# Altium schematic sheet motherboard_motor_mcu.SchDoc: =title_line_1 + title_line_2
size 840 x 594 mm; SheetNumber: 2; SheetTotal: 5
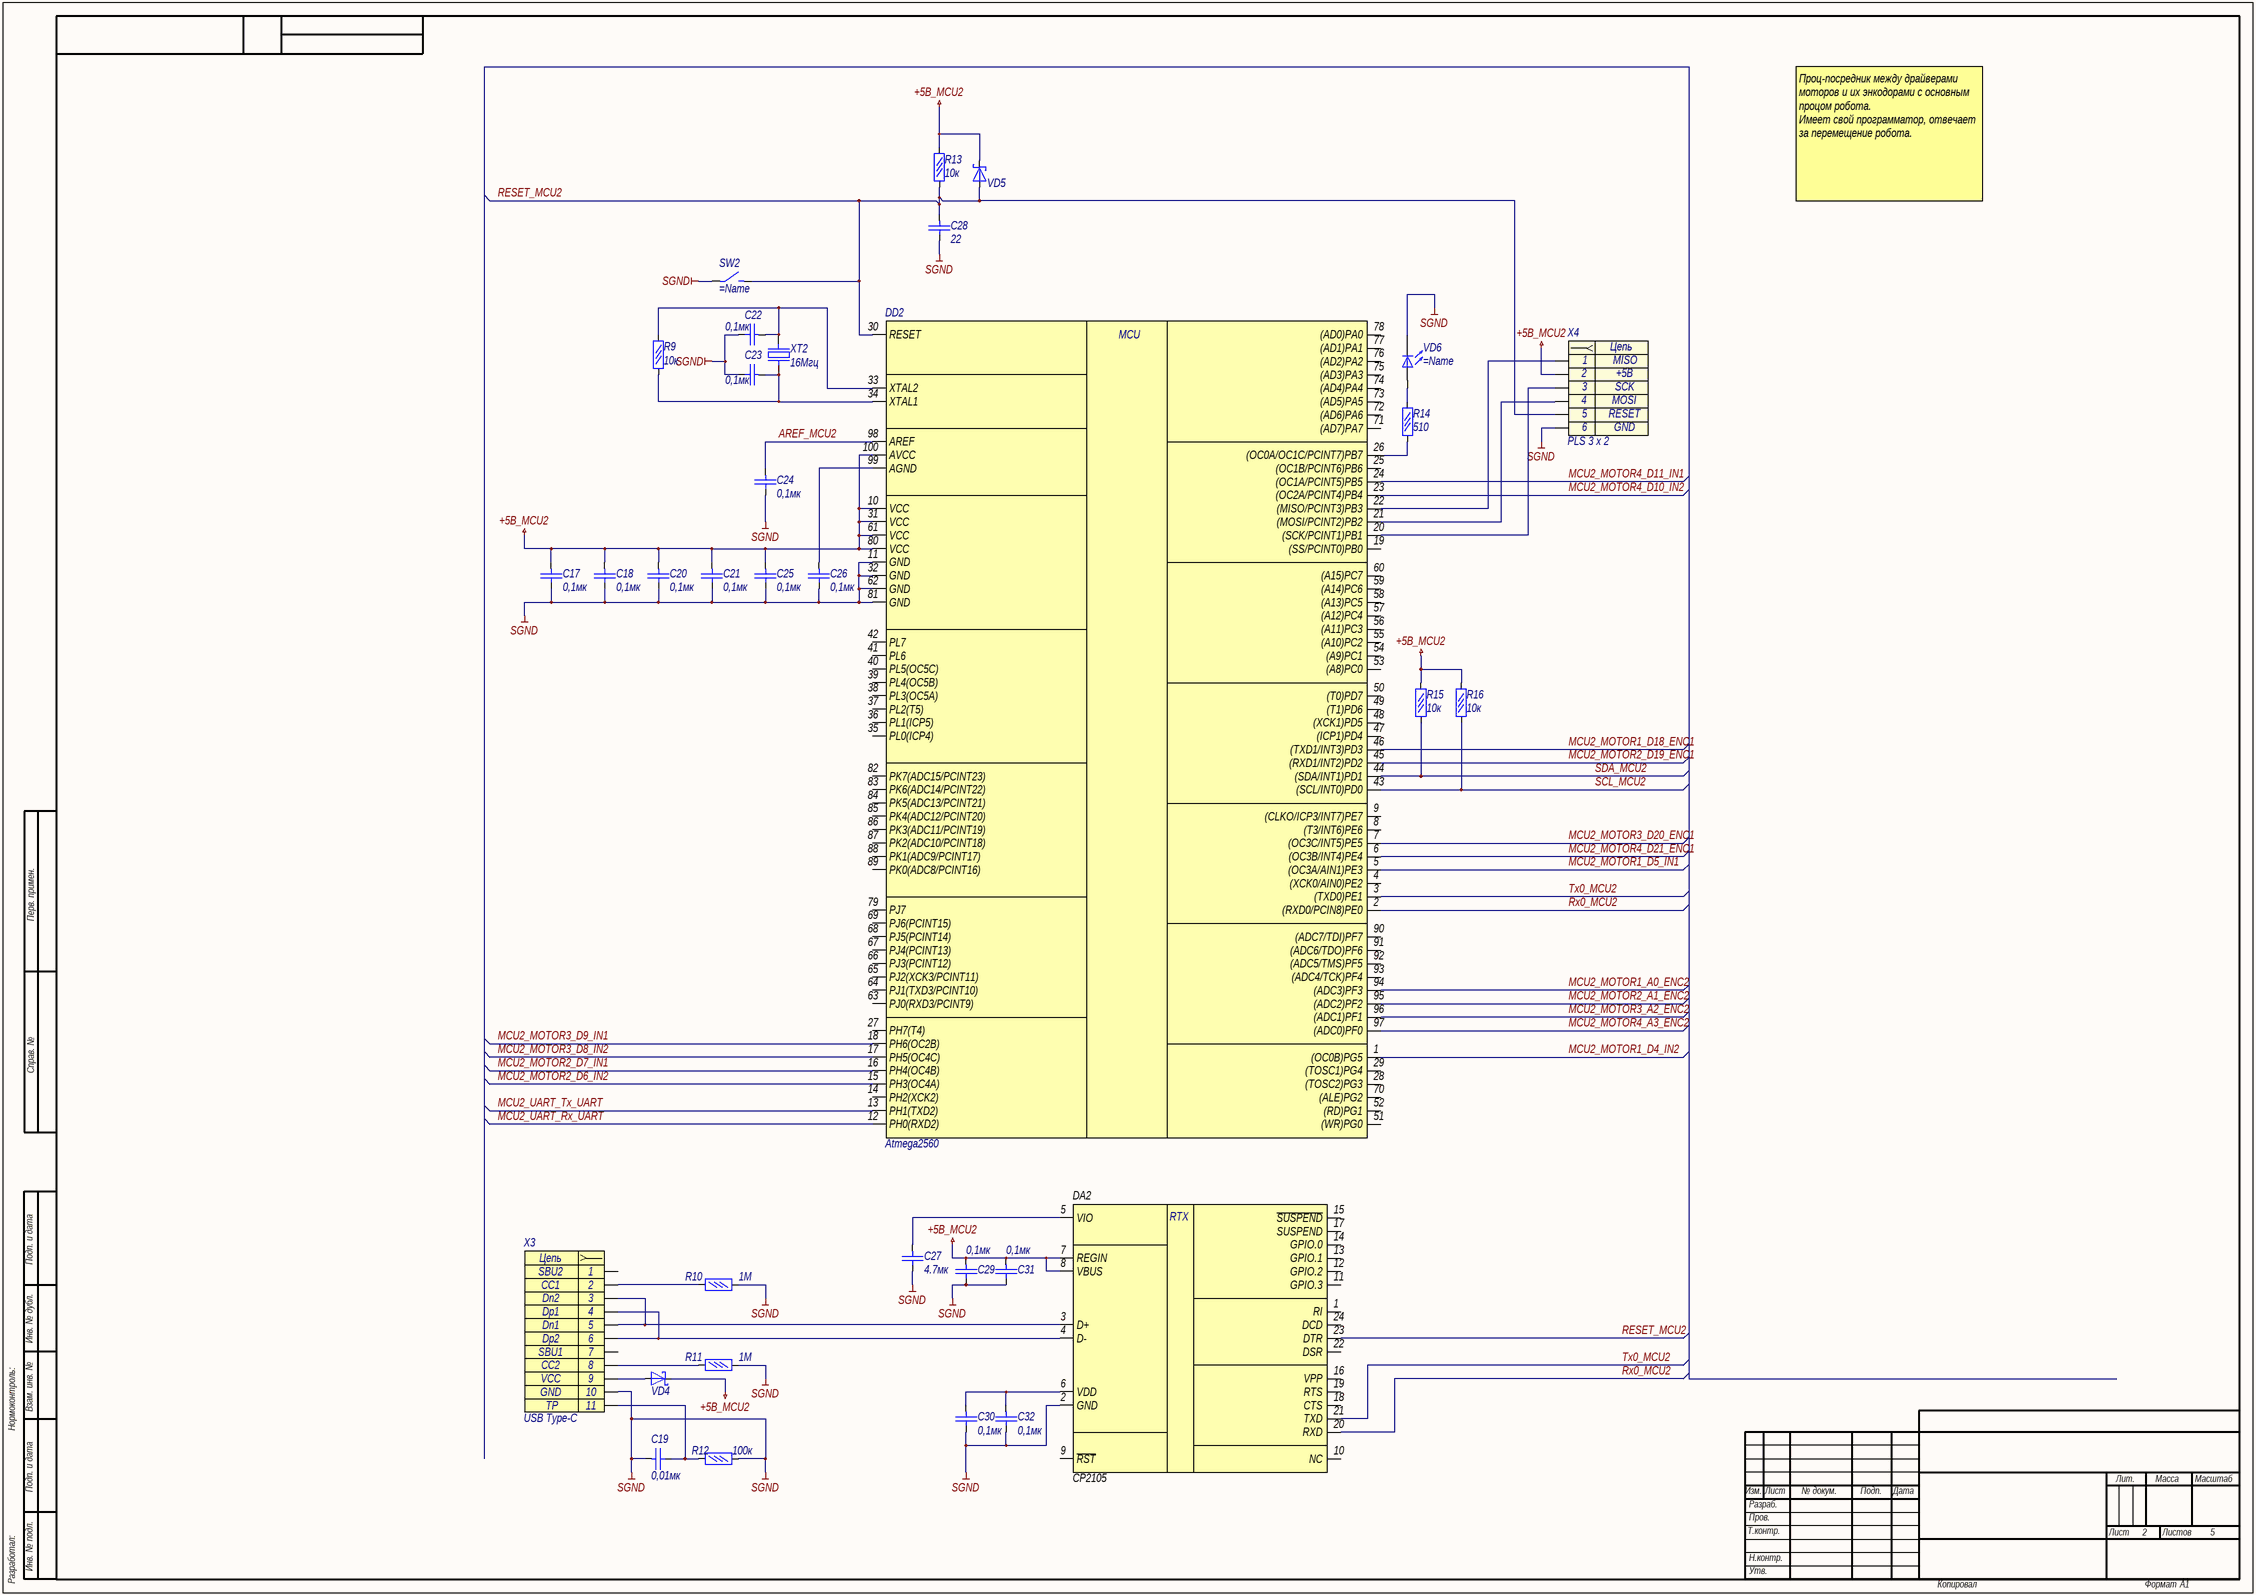
[diagram p0: motherboard_motor_mcu.SchDoc]

## Parts
DA2  CP2105  [QFN24-PAD]
DD2  Atmega2560  [100A]
R9  10к  [R0603]
R10  1М  [R0603]
R11  1М  [R0603]
R12  100к  [R0603]
R13  10к  [R0603]
R14  510  [R0603]
R15  10к  [R0603]
R16  10к  [R0603]
SW2  (no value)  [it-1187]
VD4  (no value)  [SOD123_A]
VD5  (no value)  [SOD123_A]
VD6  (no value)  [0603 - led]
X3  USB Type-C  [USB4105-15-A-120]
X4  PLS 3 x 2  [PLS 3 x 2]
XT2  16Мгц  [KX-7]
С17  0,1мк  [C0402]
С18  0,1мк  [C0402]
С19  0,01мк  [C0603]
С20  0,1мк  [C0402]
С21  0,1мк  [C0402]
С22  0,1мк  [C0402]
С23  0,1мк  [C0402]
С24  0,1мк  [C0402]
С25  0,1мк  [C0402]
С26  0,1мк  [C0402]
С27  4.7мк  [C0603]
С28  22  [C0603]
С29  0,1мк  [C0603]
С30  0,1мк  [C0603]
С31  0,1мк  [C0603]
С32  0,1мк  [C0603]

## Nets
+5В_MCU2: DA2.7(REGIN) DA2.8(VBUS) DD2.10(VCC) DD2.31(VCC) DD2.61(VCC) DD2.80(VCC) DD2.100(AVCC) R13.2 R15.1 R16.1 VD4.1(K) VD5.1(K) X4.2 С17.2 С18.2 С20.2 С21.2 С25.2 С29.2 С31.2
SGND: DA2.2(GND) DD2.11(GND) DD2.32(GND) DD2.62(GND) DD2.81(GND) R10.2 R11.2 R12.2 SW2.1 VD6.2(K) X3.10(VCC) X4.6 С17.1 С18.1 С19.2 С20.1 С21.1 С22.1 С23.1 С24.1 С25.1 С26.1 С27.1 С28.1 С29.1 С30.1 С31.1 С32.1
AREF_MCU2: DD2.98(AREF) С24.2
MCU2_MOTOR1_A0_ENC2: DD2.94((ADC3)PF3)
MCU2_MOTOR1_D4_IN2: DD2.1((OC0B)PG5)
MCU2_MOTOR1_D5_IN1: DD2.5((OC3A/AIN1)PE3)
MCU2_MOTOR1_D18_ENC1: DD2.46((TXD1/INT3)PD3)
MCU2_MOTOR2_A1_ENC2: DD2.95((ADC2)PF2)
MCU2_MOTOR2_D6_IN2: DD2.15(PH3(OC4A))
MCU2_MOTOR2_D7_IN1: DD2.16(PH4(OC4B))
MCU2_MOTOR2_D19_ENC1: DD2.45((RXD1/INT2)PD2)
MCU2_MOTOR3_A2_ENC2: DD2.96((ADC1)PF1)
MCU2_MOTOR3_D8_IN2: DD2.17(PH5(OC4C))
MCU2_MOTOR3_D9_IN1: DD2.18(PH6(OC2B))
MCU2_MOTOR3_D20_ENC1: DD2.7((OC3C/INT5)PE5)
MCU2_MOTOR4_A3_ENC2: DD2.97((ADC0)PF0)
MCU2_MOTOR4_D10_IN2: DD2.23((OC2A/PCINT4)PB4)
MCU2_MOTOR4_D11_IN1: DD2.24((OC1A/PCINT5)PB5)
MCU2_MOTOR4_D21_ENC1: DD2.6((OC3B/INT4)PE4)
MCU2_UART_Rx_UART: DD2.12(PH0(RXD2))
MCU2_UART_Tx_UART: DD2.13(PH1(TXD2))
RESET_MCU2: DA2.23(DTR) DD2.30(RESET) R13.1 SW2.2 VD5.2(A) X4.5 С28.2
Rx0_MCU2: DA2.20(RXD) DD2.2((RXD0/PCIN8)PE0)
SCL_MCU2: DD2.43((SCL/INT0)PD0) R16.2
SDA_MCU2: DD2.44((SDA/INT1)PD1) R15.2
Tx0_MCU2: DA2.21(TXD) DD2.3((TXD0)PE1)
NetDA2_3: DA2.3(D+) X3.3(B7) X3.5(A7)
NetDA2_4: DA2.4(D-) X3.4(A6) X3.6(B6)
NetDA2_5: DA2.5(VIO) С27.2
NetDA2_6: DA2.6(VDD) С30.2 С32.2
NetDD2_20: DD2.20((SCK/PCINT1)PB1) X4.3
NetDD2_21: DD2.21((MOSI/PCINT2)PB2) X4.4
NetDD2_22: DD2.22((MISO/PCINT3)PB3) X4.1
NetDD2_26: DD2.26((OC0A/OC1C/PCINT7)PB7) R14.2
NetDD2_33: DD2.33(XTAL2) R9.2 XT2.3 С22.2
NetDD2_34: DD2.34(XTAL1) R9.1 XT2.1 С23.2
NetDD2_99: DD2.99(AGND) С26.2
NetR10_1: R10.1 X3.2(A5)
NetR11_1: R11.1 X3.8(B5)
NetR12_1: R12.1 X3.TP С19.1
NetR14_1: R14.1 VD6.1(A)
NetVD4_2: VD4.2(A) X3.9(GND)

Not connected (* = marked no-connect by the designer): DA2 1(RI) 9(~{RST}) 10(NC) 11(GPIO.3) 12(GPIO.2) 13(GPIO.1) 14(GPIO.0) 15(~{SUSPEND}) 16(VPP) 17(SUSPEND) 18(CTS) 19(RTS) 22(DSR) 24(DCD); DD2 4((XCK0/AIN0)PE2) 8((T3/INT6)PE6) 9((CLKO/ICP3/INT7)PE7) 14(PH2(XCK2)) 19((SS/PCINT0)PB0) 25((OC1B/PCINT6)PB6) 27(PH7(T4)) 28((TOSC2)PG3) 29((TOSC1)PG4) 35(PL0(ICP4)) 36(PL1(ICP5)) 37(PL2(T5)) 38(PL3(OC5A)) 39(PL4(OC5B)) 40(PL5(OC5C)) 41(PL6) 42(PL7) 47((ICP1)PD4) 48((XCK1)PD5) 49((T1)PD6) 50((T0)PD7) 51((WR)PG0) 52((RD)PG1) 53((A8)PC0) 54((A9)PC1) 55((A10)PC2) 56((A11)PC3) 57((A12)PC4) 58((A13)PC5) 59((A14)PC6) 60((A15)PC7) 63(PJ0(RXD3/PCINT9)) 64(PJ1(TXD3/PCINT10)) 65(PJ2(XCK3/PCINT11)) 66(PJ3(PCINT12)) 67(PJ4(PCINT13)) 68(PJ5(PCINT14)) 69(PJ6(PCINT15)) 70((ALE)PG2) 71((AD7)PA7) 72((AD6)PA6) 73((AD5)PA5) 74((AD4)PA4) 75((AD3)PA3) 76((AD2)PA2) 77((AD1)PA1) 78((AD0)PA0) 79(PJ7) 82(PK7(ADC15/PCINT23)) 83(PK6(ADC14/PCINT22)) 84(PK5(ADC13/PCINT21)) 85(PK4(ADC12/PCINT20)) 86(PK3(ADC11/PCINT19)) 87(PK2(ADC10/PCINT18)) 88(PK1(ADC9/PCINT17)) 89(PK0(ADC8/PCINT16)) 90((ADC7/TDI)PF7) 91((ADC6/TDO)PF6) 92((ADC5/TMS)PF5) 93((ADC4/TCK)PF4); X3 1(B8) 7(A8)

## Notes on the sheet
- Проц-посредник между драйверами моторов и их энкодорами с основным процом робота.
  Имеет свой программатор, отвечает за перемещение робота.
- Перв. примен.
- Справ. №
- Подп. и дата
- Инв. № дубл.
- Нормоконтроль:
- Взам. инв. №
- Изм.
- Лист
- № докум.
- Подп.
- Дата
- Лит.
- Масса
- Масштаб
- Т.контр.
- Пров.
- Разраб.
- Листов
- Разработал:
- Инв. № подл.
- Н.контр.
- Утв.
- Копировал
- Формат
- А1
- (in symbol Anmega_2560) MCU
- (in symbol CP2104) RTX
- (in symbol PLS 3 x 2) Цепь
- (in symbol USB4105) Цепь; 11

## Library data of the parts
DA2 = CP2104: Наименование: CP2105
DD2 = Anmega_2560: Name: Atmega2560
R9-R16 = Резистор 0.05Вт: Резистор 0,05Вт
  R9 R13 R15 R16: Value: 10к
  R10 R11: Value: 1М
  R12: Value: 100к
  R14: Value: 510
SW2 = button
VD4 VD5 = DiodeSchottky: Диод Шоттки
VD6 = smd_led: smd led
X3 = USB4105: USB Type-C USB4105-GF-A / GCT; Contact_1: SBU2; Contact_2: CC1; Contact_3: Dn2; Contact_4: Dp1; Contact_5: Dn1; Contact_6: Dp2; Contact_7: SBU1; Contact_8: CC2; Contact_9: VCC; Contact_10: GND; Name: USB Type-C
X4 = PLS 3 x 2: Contact_1: MISO; Contact_2: +5В; Contact_3: SCK; Contact_4: MOSI; Contact_5: RESET; Contact_6: GND; Name: PLS 3 x 2
XT2 = Резонатор: 12.88605 / Geyer; Name: 12.88605; Value: 16Мгц
С17-С32 = Кер. конденсатор
  С17 С18 С20-С26 С29-С32: Value: 0,1мк
  С19: Value: 0,01мк
  С27: Value: 4.7мк
  С28: Value: 22